# Altium schematic sheet RS485_USB.SchDoc
size A3; Address1: Address1; Address2: Address2; Address3: Address3; Address4: Address4
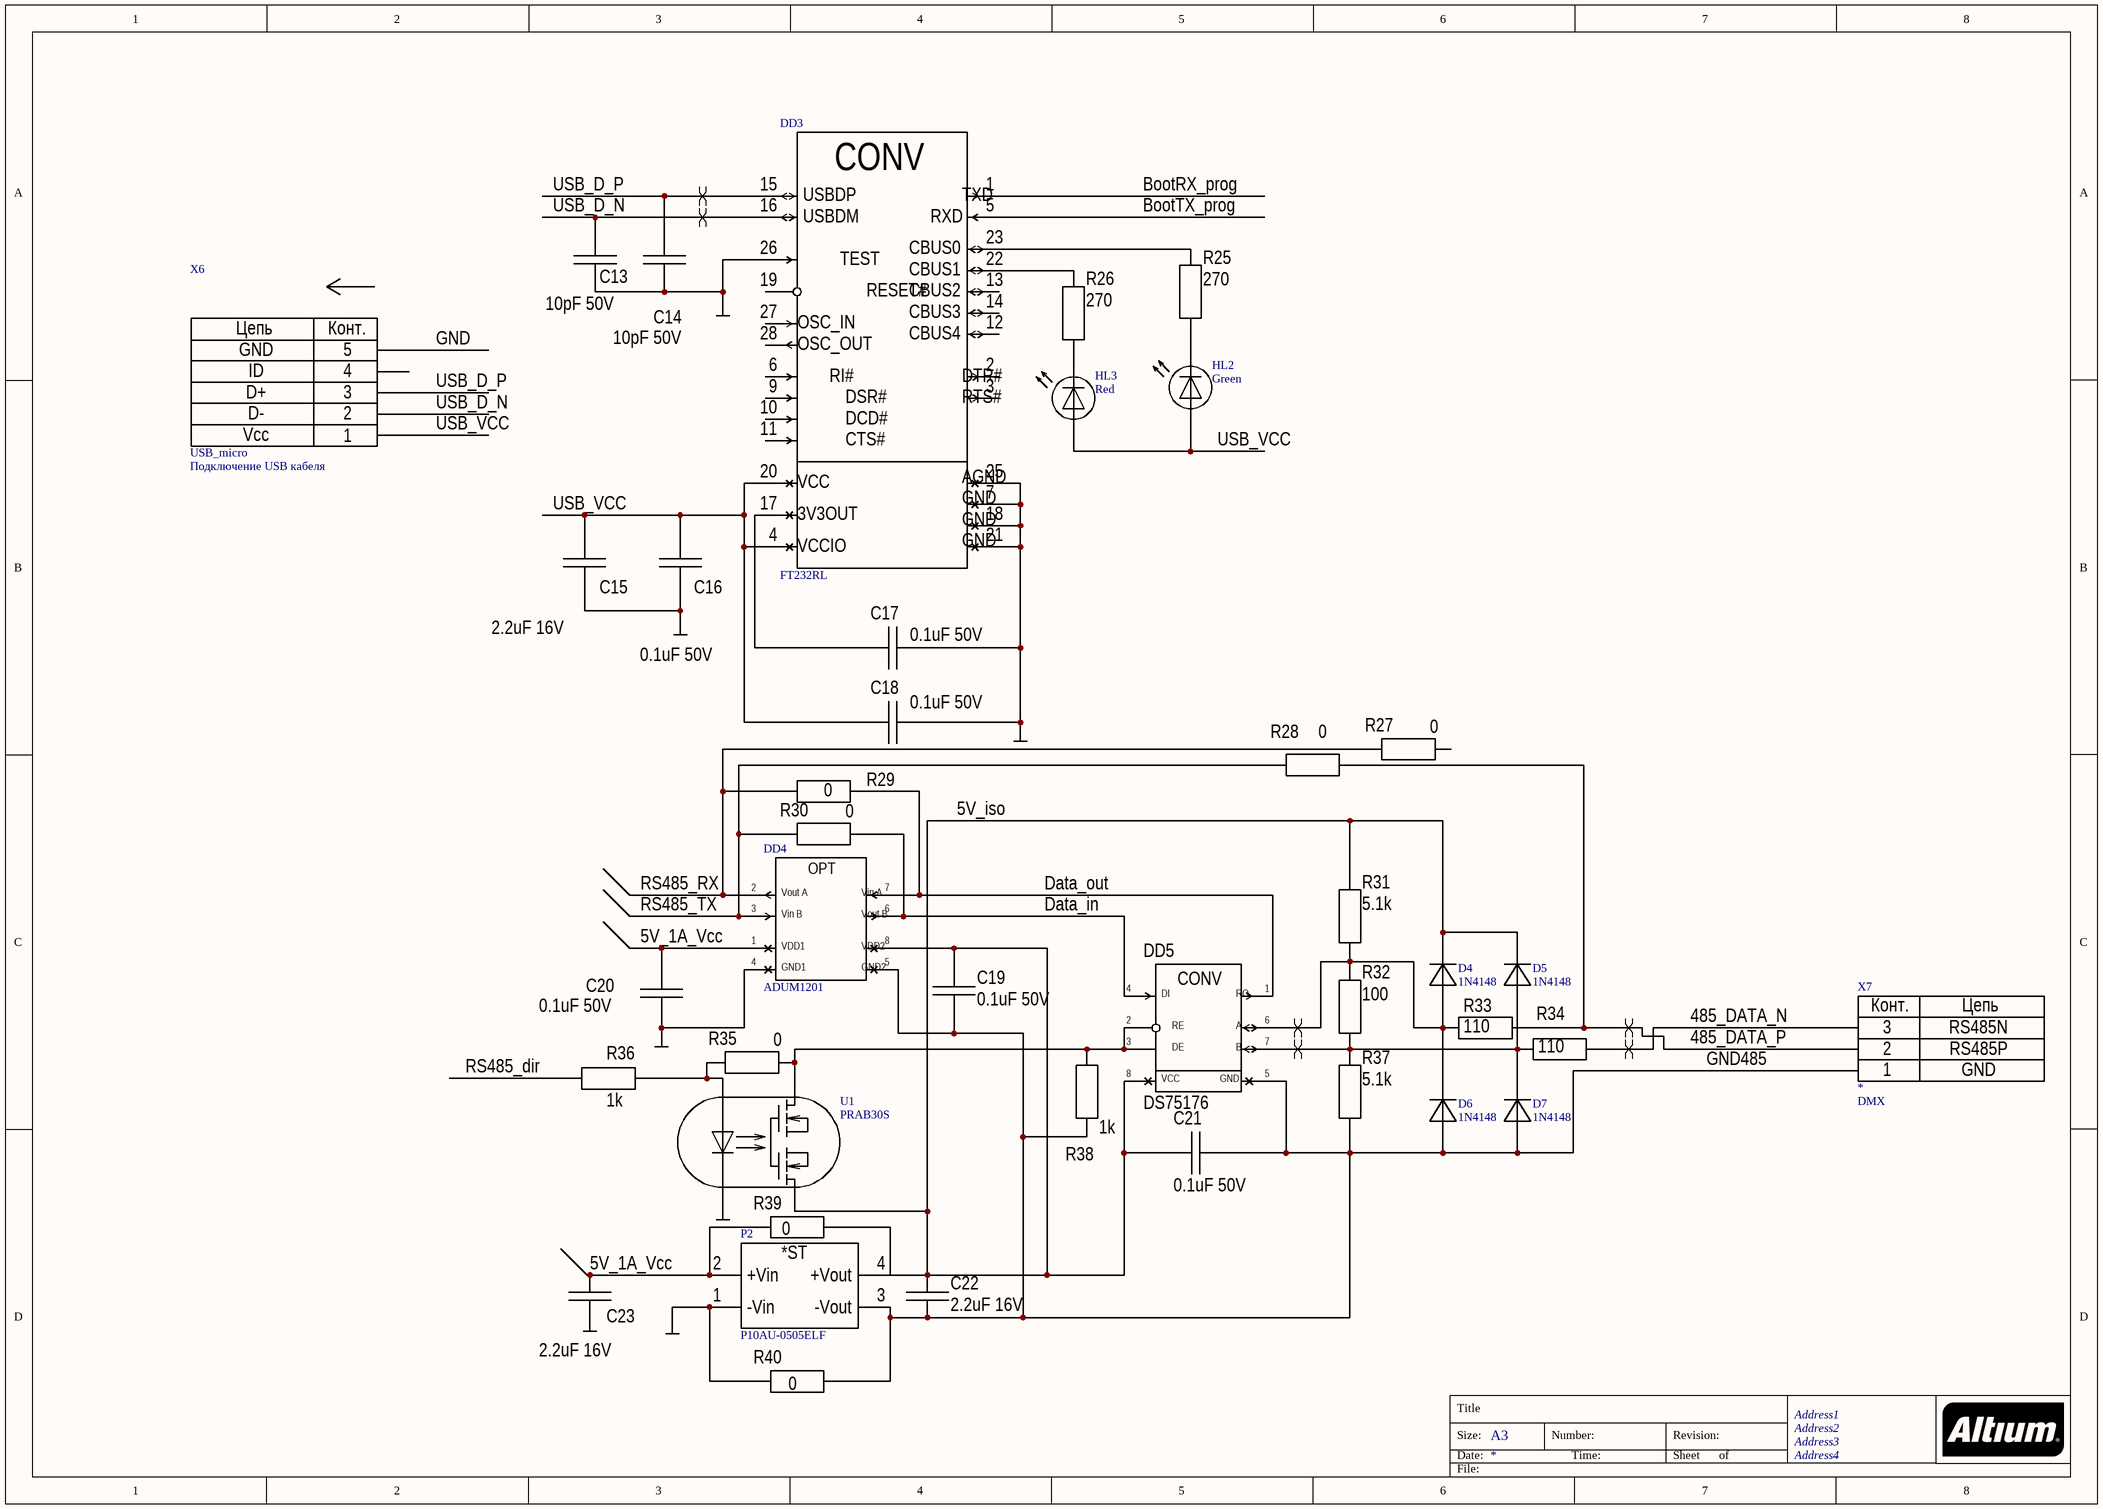
[diagram p0: RS485_USB.SchDoc]

## Parts
C13  10pF 50V  [0805_CAP]
C14  10pF 50V  [0805_CAP]
C15  2.2uF 16V  [0805_CAP]
C16  0.1uF 50V  [0805_CAP]
C17  0.1uF 50V  [0805_CAP]
C18  0.1uF 50V  [0805_CAP]
C19  0.1uF 50V  [0805_CAP]
C20  0.1uF 50V  [0805_CAP]
C21  0.1uF 50V  [0805_CAP]
C22  2.2uF 16V  [0805_CAP]
C23  2.2uF 16V  [0805_CAP]
D4  1N4148  [sod80c]
D5  1N4148  [sod80c]
D6  1N4148  [sod80c]
D7  1N4148  [sod80c]
DD3  FT232RL  [SSOP28]
DD4  ADUM1201  [soic-8]
DD5  DS75176  [soic-8]
HL2  Green  [0603_led_ipc]
HL3  Red  [0603_led_ipc]
P2  P10AU-0505ELF  [SIP4]
R25  270  [0805_RES]
R26  270  [0805_RES]
R27  0  [0805_RES]
R28  0  [0805_RES]
R29  0  [0805_RES]
R30  0  [0805_RES]
R31  5.1k  [0805_RES]
R32  100  [0805_RES]
R33  110  [0805_RES]
R34  110  [0805_RES]
R35  0  [0805_RES]
R36  1k  [0805_RES]
R37  5.1k  [0805_RES]
R38  1k  [0805_RES]
R39  0  [0805_RES]
R40  0  [0805_RES]
U1  PRAB30S  [sop4_optocoup]
X6  USB_micro  Назначение: Подключение USB кабеля  [usb_micro]
X7  *  Destiny: DMX  [3pad_5.08]

## Nets
GND: C13.1 C14.1 C15.1 C16.1 C17.1 C18.1 C20.2 C23.1 DD3.7 DD3.18 DD3.21 DD3.25 DD3.26 DD4.4 P2.1(-Vin) R40.1 U1.2(C) X6.5
5V_1A_Vcc: C20.1 C23.2 DD4.1(A1) P2.2(+Vin) R39.1
5V_iso: C19.1 C21.1 C22.2 D4.2 D5.2 DD4.8 DD5.8 P2.4(+Vout) R31.1 R39.2 U1.3(E)
485_DATA_N: R34.2 X7.3
485_DATA_P: R28.2 R33.2 X7.2
BootRX_prog: DD3.1
BootTX_prog: DD3.5
Data_in: DD4.6 DD5.4 R30.2
Data_out: DD4.7 DD5.1 R29.2
GND485: C19.2 C21.2 C22.1 D6.1 D7.1 DD4.5 DD5.5 P2.3(-Vout) R37.2 R38.2 R40.2 X7.1
RS485_dir: R36.1
RS485_RX: DD4.2 R27.1 R29.1
RS485_TX: DD4.3 R28.1 R30.1
USB_D_N: C13.2 DD3.16 X6.2
USB_D_P: C14.2 DD3.15 X6.3
USB_VCC: C15.2 C16.2 C18.2 DD3.4 DD3.20 HL2.1 HL3.1 X6.1
NetC17_2: C17.2 DD3.17
NetD4_1: D4.1 D6.2 DD5.6 R31.2 R32.1 R33.1
NetD5_1: D5.1 D7.2 DD5.7 R32.2 R34.1 R37.1
NetDD3_22: DD3.22 R26.2
NetDD3_23: DD3.23 R25.2
NetDD5_2: DD5.2 DD5.3 R35.2 R38.1 U1.4(C)
NetHL2_2: HL2.2 R25.1
NetHL3_2: HL3.2 R26.1
NetR35_1: R35.1 R36.2 U1.1(A)

Not connected (* = marked no-connect by the designer): DD3 2 3 6 9 10 11 12 13 14 19 27 28; R27 2; X6 4

## Layout directives
differential pair: 485_DATA_N, 485_DATA_P, NetD4_1, NetD5_1, USB_D_N, USB_D_P

## Notes on the sheet
- Title
- Size:
- Date:
- A3
- Number:
- Time:
- Revision:
- Sheet
- of
- File:
- (in symbol 3pin_conn) Конт.; Цепь
- (in symbol ADUM1201) OPT; Vout A; Vin A; Vin B; Vout B; VDD1; VDD2; GND1; GND2
- (in symbol ds75176) CONV; DI; RO; RE; A; DE; B; VCC; GND
- (in symbol FT232RL) CONV; USBDP; TXD; USBDM; RXD; CBUS0; TEST; CBUS1; RESET#; CBUS2; CBUS3; OSC_IN; CBUS4; OSC_OUT; RI#; DTR#; DSR#; RTS#; DCD#; CTS#; VCC; AGND; GND; 3V3OUT; VCCIO
- (in symbol P10AU) *ST
- (in symbol USB_micro) Цепь; Конт.; GND; ID; D+; D-; Vcc

## Library data of the parts
C13-C23 = Cap_np
  C13 C14: Value: 10pF 50V
  C15 C22 C23: Value: 2.2uF 16V
  C16-C21: Value: 0.1uF 50V
D4-D7 = Diode: Value: 1N4148
HL2 HL3 = led
  HL2: Value: Green
  HL3: Value: Red
P2 = P10AU: Value: P10AU-0505ELF
R25-R40 = Res
  R25 R26: Value: 270
  R27-R30 R35 R39 R40: Value: 0
  R31 R37: Value: 5.1k
  R32: Value: 100
  R33 R34: Value: 110
  R36 R38: Value: 1k
U1 = Opto_Realy: Value: PRAB30S
X7 = 3pin_conn: PinName1: GND; PinName2: RS485P; PinName3: RS485N; Value: *
DD3 = FT232RL: Value: FT232RL
DD4 = ADUM1201: Value: ADUM1201
DD5 = ds75176: Value: DS75176
X6 = USB_micro: Value: USB_micro